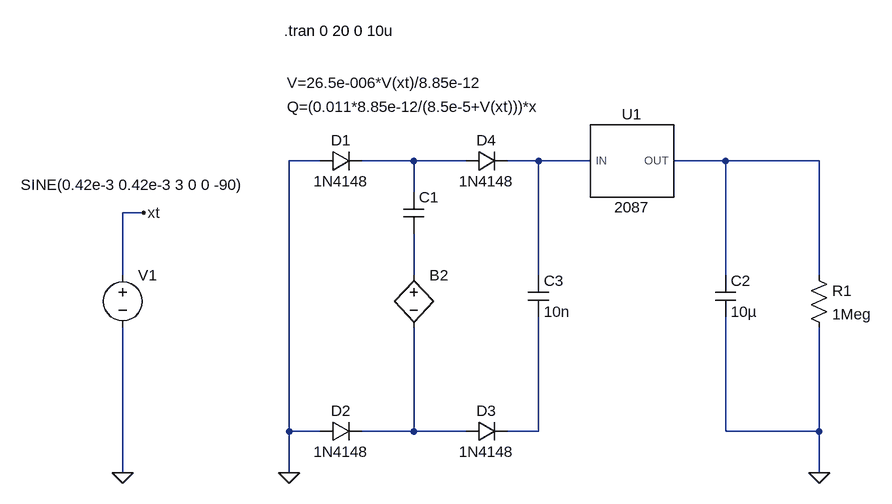
[diagram p0: schematic TENG_GDT.asc]
TENG_GDT.asc, the LTspice schematic file:
Version 4.1
SHEET 1 1624 720
WIRE 384 -16 336 -16
WIRE 528 -16 448 -16
WIRE 608 -16 528 -16
WIRE 720 -16 672 -16
WIRE 800 -16 720 -16
WIRE 1008 -16 928 -16
WIRE 1152 -16 1008 -16
WIRE 528 32 528 -16
WIRE 112 64 80 64
WIRE 80 160 80 64
WIRE 528 160 528 96
WIRE 720 160 720 -16
WIRE 1008 160 1008 -16
WIRE 1152 160 1152 -16
WIRE 336 400 336 -16
WIRE 384 400 336 400
WIRE 528 400 528 240
WIRE 528 400 448 400
WIRE 608 400 528 400
WIRE 720 400 720 224
WIRE 720 400 672 400
WIRE 1008 400 1008 224
WIRE 1152 400 1152 240
WIRE 1152 400 1008 400
WIRE 80 464 80 240
WIRE 336 464 336 400
WIRE 1152 464 1152 400
FLAG 336 464 0
FLAG 80 464 0
FLAG 112 64 xt
FLAG 1152 464 0
SYMBOL bv 528 144 R0
WINDOW 3 -195 -280 Left 2
SYMATTR Value V=26.5e-006*V(xt)/8.85e-12
SYMATTR InstName B2
SYMBOL cap 512 32 R0
WINDOW 3 -179 -131 Left 2
SYMATTR Value Q=(0.011*8.85e-12/(8.5e-5+V(xt)))*x
SYMATTR InstName C1
SYMBOL diode 384 0 R270
WINDOW 0 32 32 VTop 2
WINDOW 3 0 32 VBottom 2
SYMATTR InstName D1
SYMATTR Value 1N4148
SYMBOL diode 384 416 R270
WINDOW 0 32 32 VTop 2
WINDOW 3 0 32 VBottom 2
SYMATTR InstName D2
SYMATTR Value 1N4148
SYMBOL diode 608 416 R270
WINDOW 0 32 32 VTop 2
WINDOW 3 0 32 VBottom 2
SYMATTR InstName D3
SYMATTR Value 1N4148
SYMBOL diode 608 0 R270
WINDOW 0 32 32 VTop 2
WINDOW 3 0 32 VBottom 2
SYMATTR InstName D4
SYMATTR Value 1N4148
SYMBOL voltage 80 144 R0
WINDOW 3 -157 -123 Left 2
SYMATTR Value SINE(0.42e-3 0.42e-3 3 0 0 -90)
SYMATTR InstName V1
SYMBOL GDT 864 -16 R0
SYMATTR InstName U1
SYMATTR Value 2087
SYMATTR SpiceLine dcVmax=100 Vmax1=200 Vmax2=190 Vglow=45 Varc=15
SYMBOL cap 992 160 R0
SYMATTR InstName C2
SYMATTR Value 10µ
SYMBOL res 1136 144 R0
SYMATTR InstName R1
SYMATTR Value 1Meg
SYMBOL cap 704 160 R0
SYMATTR InstName C3
SYMATTR Value 10n
TEXT 328 -216 Left 2 !.tran 0 20 0 10u

The netlist it stands for:
* TENG_GDT.asc
B2 N004 N005 V=26.5e-006*V(xt)/8.85e-12
C1 N001 N004 Q=(0.011*8.85e-12/(8.5e-5+V(xt)))*x
D1 0 N001 1N4148
D2 0 N005 1N4148
D3 N005 N006 1N4148
D4 N001 N002 1N4148
V1 xt 0 SINE(0.42e-3 0.42e-3 3 0 0 -90)
X§U1 N002 N003 2087 dcVmax=100 Vmax1=200 Vmax2=190 Vglow=45 Varc=15  ; pins IN OUT
C2 N003 0 10µ
R1 N003 0 1Meg
C3 N002 N006 10n
.model D D
.lib standard.dio
.tran 0 20 0 10u
.lib ./2087.lib
.backanno
.end